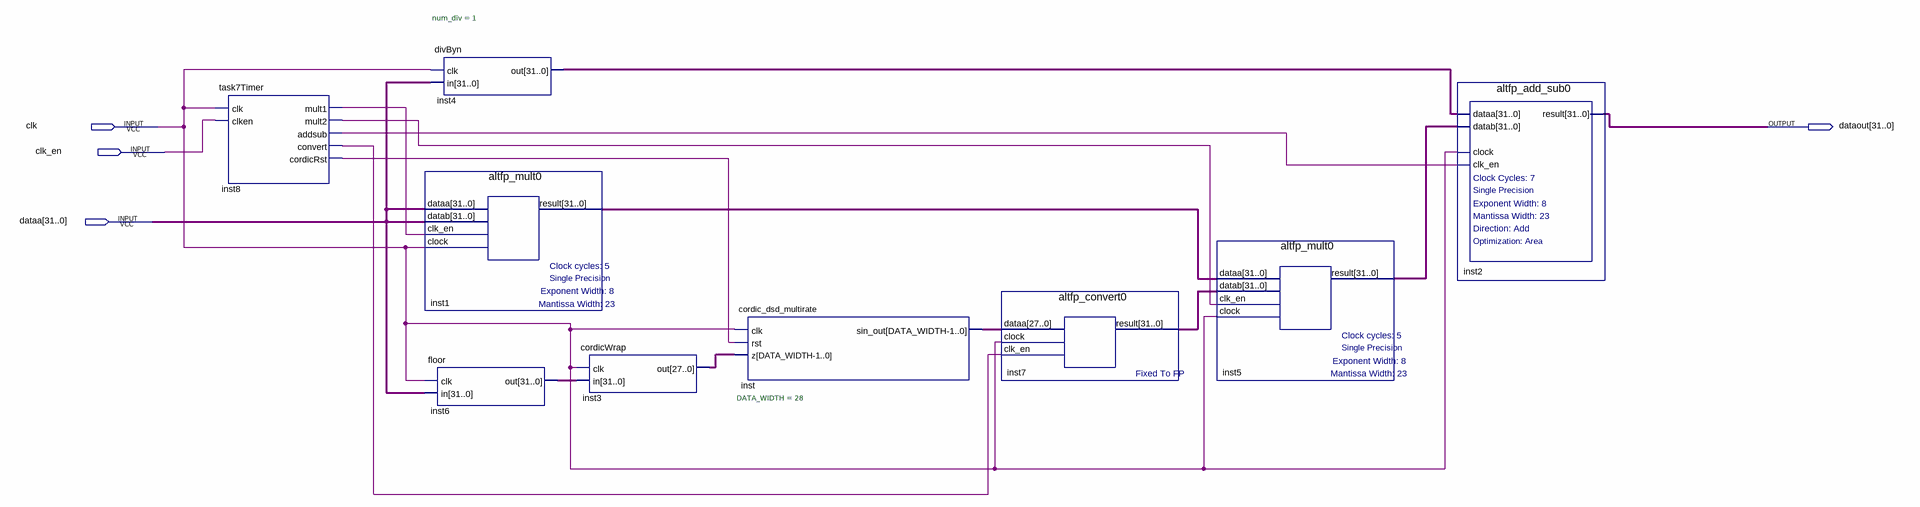
[diagram p0: schematic sheet]
// Quartus schematic Task7.bdf as structural Verilog: 9 symbols, 4 pins
module Task7 (
  input  clk,
  input  clk_en,
  input  [31:0] dataa,
  output [31:0] dataout
);

  wire inst8_addsub, inst8_convert, inst8_cordicrst, inst8_mult1, inst8_mult2;
  wire [27:0] inst3_out, inst_sin_out;
  wire [31:0] inst1_result, inst4_out, inst5_result, inst6_out, inst7_result;

  task7Timer inst8 (
    .clk(clk), .clken(clk_en), .mult1(inst8_mult1), .mult2(inst8_mult2), .addsub(inst8_addsub),
    .convert(inst8_convert), .cordicRst(inst8_cordicrst));
  divByn #(.num_div(1)) inst4 (.clk(clk), .in(dataa), .out(inst4_out));
  altfp_mult0 inst1 (.dataa(dataa), .datab(dataa), .clk_en(inst8_mult1), .clock(clk), .result(inst1_result));
  floor inst6 (.clk(clk), .in(dataa), .out(inst6_out));
  cordicWrap inst3 (.clk(clk), .in(inst6_out), .out(inst3_out));
  cordic_dsd_multirate #(.DATA_WIDTH(28)) inst (
    .clk(clk), .rst(inst8_cordicrst), .z(inst3_out), .sin_out(inst_sin_out));
  altfp_convert0 inst7 (.dataa(inst_sin_out), .clock(clk), .clk_en(inst8_convert), .result(inst7_result));
  altfp_mult0 inst5 (
    .dataa(inst1_result), .datab(inst7_result), .clk_en(inst8_mult2), .clock(clk), .result(inst5_result));
  altfp_add_sub0 inst2 (.dataa(inst4_out), .datab(inst5_result), .clock(clk), .clk_en(inst8_addsub), .result(dataout));
endmodule
